# Altium schematic sheet Touch Sensors.SchDoc: =SheetTitle
size A4; CompanyName: Catcatcat Electronics; Engineer: Hena Chernov; SheetNumber: 9; SheetTotal: 10; CodePhone: +380505759863; SheetDescription: Capacitive touch buttons.; Email: catcatcat.electronics@gmail.com
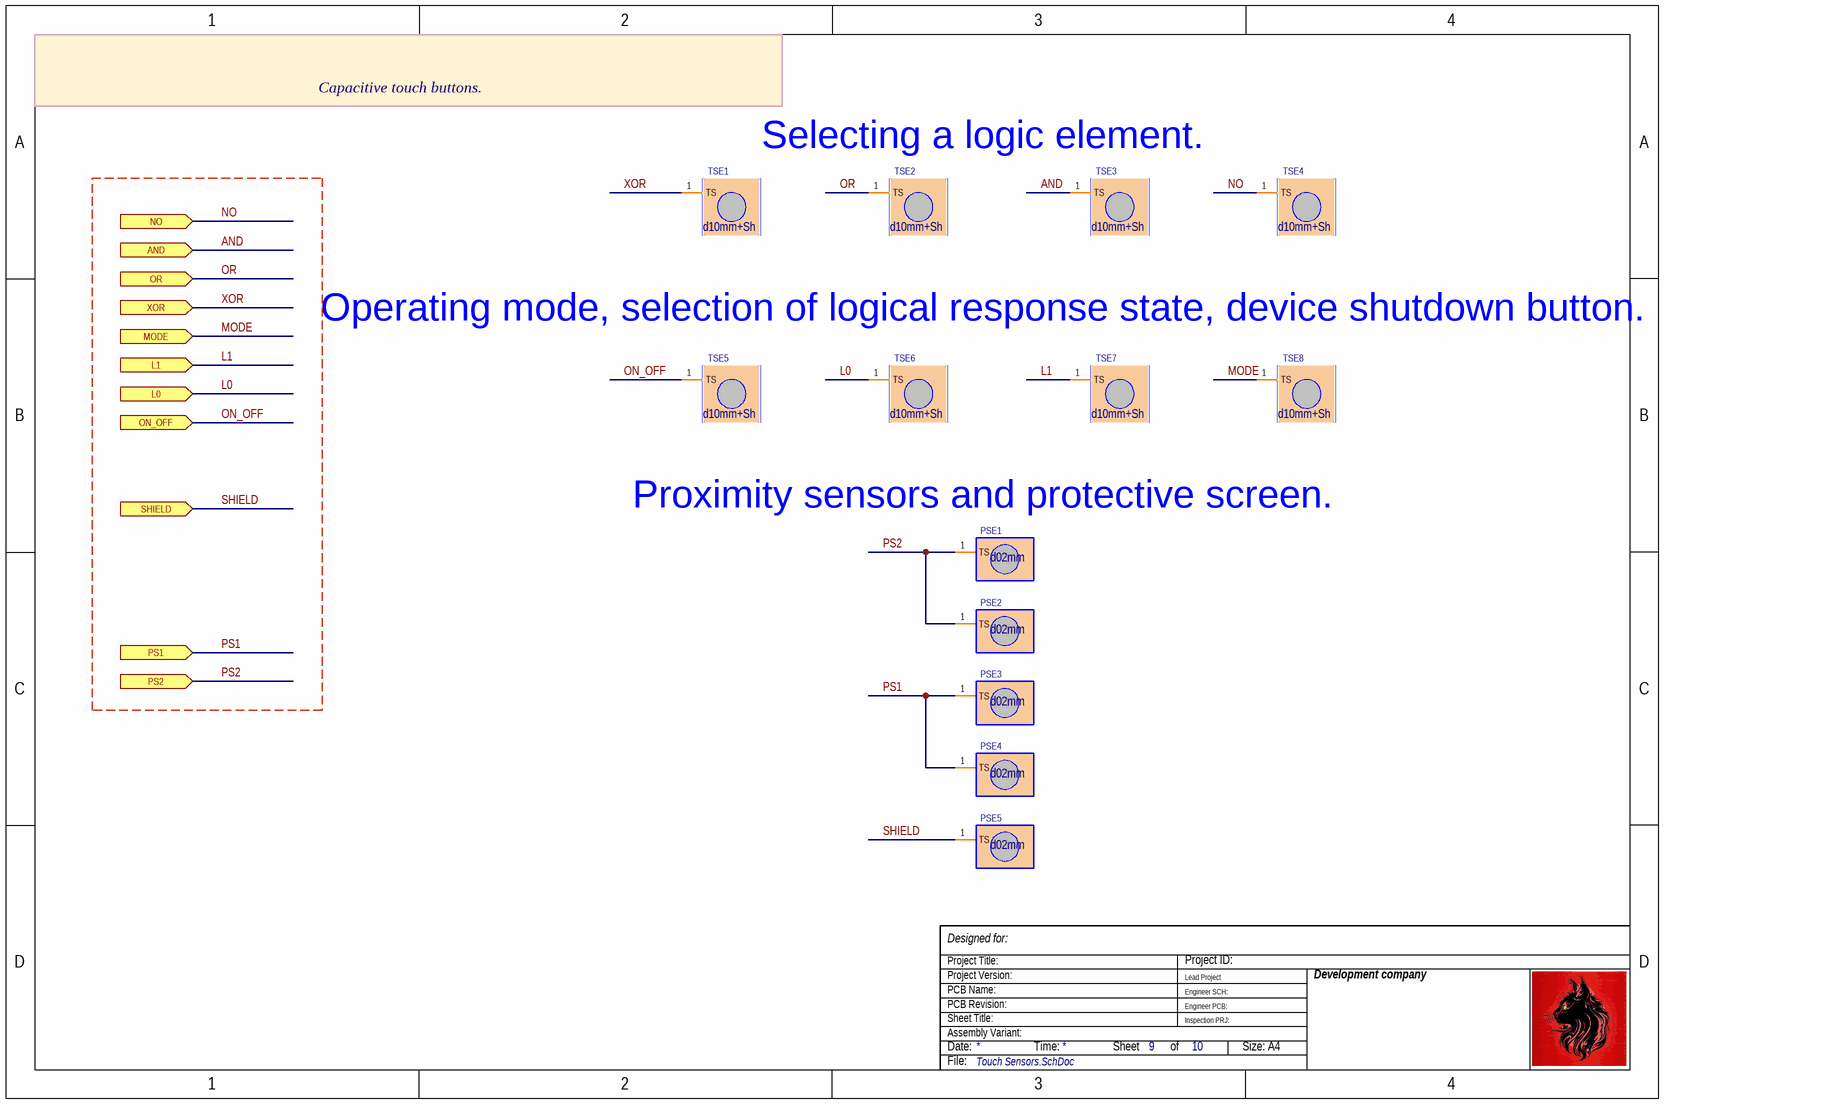
[diagram p0: Touch Sensors.SchDoc]

## Parts
PSE1  Connection point  [Connection point]  (value not drawn)  (no BOM)
PSE2  Connection point  [Connection point]  (value not drawn)  (no BOM)
PSE3  Connection point  [Connection point]  (value not drawn)  (no BOM)
PSE4  Connection point  [Connection point]  (value not drawn)  (no BOM)
PSE5  Connection point  [Connection point]  (value not drawn)  (no BOM)
TSE1  Touch Sensors d10mm_Z  [Circle d10mm_NOV1]  (value not drawn)  (no BOM)
TSE2  Touch Sensors d10mm_Z  [Circle d10mm_NOV1]  (value not drawn)  (no BOM)
TSE3  Touch Sensors d10mm_Z  [Circle d10mm_NOV1]  (value not drawn)  (no BOM)
TSE4  Touch Sensors d10mm_Z  [Circle d10mm_NOV1]  (value not drawn)  (no BOM)
TSE5  Touch Sensors d10mm_Z  [Circle d10mm_NOV1]  (value not drawn)  (no BOM)
TSE6  Touch Sensors d10mm_Z  [Circle d10mm_NOV1]  (value not drawn)  (no BOM)
TSE7  Touch Sensors d10mm_Z  [Circle d10mm_NOV1]  (value not drawn)  (no BOM)
TSE8  Touch Sensors d10mm_Z  [Circle d10mm_NOV1]  (value not drawn)  (no BOM)

## Ports
AND (in), L0 (in), L1 (in), MODE (in), NO (in), ON_OFF (in), OR (in), PS1 (in), PS2 (in), SHIELD (in), XOR (in)

## Nets
AND: TSE3.1(TS) ; port AND
L0: TSE6.1(TS) ; port L0
L1: TSE7.1(TS) ; port L1
MODE: TSE8.1(TS) ; port MODE
NO: TSE4.1(TS) ; port NO
ON_OFF: TSE5.1(TS) ; port ON_OFF
OR: TSE2.1(TS) ; port OR
PS1: PSE3.1(TS) PSE4.1(TS) ; port PS1
PS2: PSE1.1(TS) PSE2.1(TS) ; port PS2
SHIELD: PSE5.1(TS) ; port SHIELD
XOR: TSE1.1(TS) ; port XOR

## Notes on the sheet
- Selecting a logic element.
- Operating mode, selection of logical response state, device shutdown button.
- (near PSE1) Proximity sensors and protective screen.
- Project Title:
- Project Version:
- Designed for:
- Lead Project
- Project ID:
- Development company
- Date:
- PCB Revision:
- PCB Name:
- Sheet Title:
- Assembly Variant:
- Time:
- Sheet
- of
- Engineer SCH:
- Engineer PCB:
- Inspection PRJ:
- Size: A4
- File:
- (in symbol Connection point) d02mm
- (in symbol Touch Sensors d10mm_Z) d10mm+Sh

## Library data of the parts
PSE1-PSE5 = Connection point: Proximity sensor,; Value: *; Assembly type: PCB component; Case/Package: d2mm; Publisher: Catcatcat Electronics; Website Developer: http://catcatcat.d-lan.dp.ua/; Footprint check status: Verified
TSE1-TSE8 = Touch Sensors d10mm_Z: Touch Sensors,; Value: *; Assembly type: PCB component; Case/Package: d10mm; Publisher: Catcatcat Electronics; Website Developer: http://catcatcat.d-lan.dp.ua/; Footprint check status: Verified